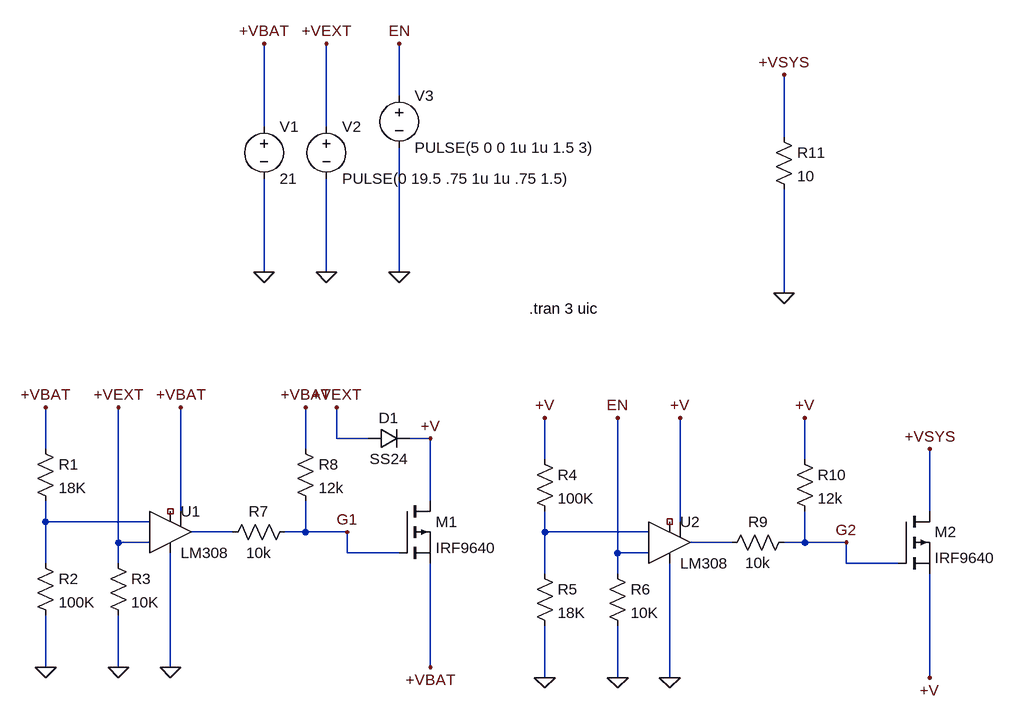
[diagram p0: schematic Arbitrador de Fuente.asc]
Arbitrador de Fuente.asc, the LTspice schematic file:
Version 4.1
SHEET 1 1296 680
WIRE 64 -544 64 -624
WIRE -144 -496 -144 -624
WIRE -48 -496 -48 -624
WIRE 656 -480 656 -576
WIRE -144 -272 -144 -416
WIRE -48 -272 -48 -416
WIRE 64 -272 64 -464
WIRE 656 -240 656 -400
WIRE -32 -16 -32 -64
WIRE 16 -16 -32 -16
WIRE 112 -16 80 -16
WIRE -480 0 -480 -64
WIRE -80 0 -80 -64
WIRE 288 16 288 -48
WIRE 688 16 688 -48
WIRE 112 80 112 -16
WIRE -272 96 -272 -64
WIRE 880 96 880 0
WIRE -480 112 -480 80
WIRE -320 112 -480 112
WIRE 496 112 496 -48
WIRE -192 128 -256 128
WIRE -80 128 -80 80
WIRE -80 128 -112 128
WIRE -16 128 -80 128
WIRE 288 128 288 96
WIRE 448 128 288 128
WIRE -368 144 -368 -64
WIRE -320 144 -368 144
WIRE 576 144 512 144
WIRE 688 144 688 96
WIRE 688 144 656 144
WIRE 752 144 688 144
WIRE -16 160 -16 128
WIRE 64 160 -16 160
WIRE 400 160 400 -48
WIRE 448 160 400 160
WIRE -480 176 -480 112
WIRE -368 176 -368 144
WIRE 752 176 752 144
WIRE 832 176 752 176
WIRE 288 192 288 128
WIRE 400 192 400 160
WIRE -480 336 -480 256
WIRE -368 336 -368 256
WIRE -288 336 -288 160
WIRE 112 336 112 176
WIRE 288 352 288 272
WIRE 400 352 400 272
WIRE 480 352 480 176
WIRE 880 352 880 192
FLAG -144 -272 0
FLAG -144 -624 +VBAT
FLAG -48 -272 0
FLAG -48 -624 +VEXT
FLAG 112 336 +VBAT
FLAG -32 -64 +VEXT
FLAG -480 336 0
FLAG -480 -64 +VBAT
FLAG -368 -64 +VEXT
FLAG -368 336 0
FLAG -272 -64 +VBAT
FLAG -16 128 G1
FLAG -288 336 0
FLAG 64 -624 EN
FLAG 64 -272 0
FLAG 112 -16 +V
FLAG -80 -64 +VBAT
FLAG 288 352 0
FLAG 400 352 0
FLAG 752 144 G2
FLAG 480 352 0
FLAG 880 0 +VSYS
FLAG 288 -48 +V
FLAG 880 352 +V
FLAG 496 -48 +V
FLAG 688 -48 +V
FLAG 400 -48 EN
FLAG 656 -240 0
FLAG 656 -576 +VSYS
SYMBOL voltage -144 -512 R0
WINDOW 123 0 0 Left 0
WINDOW 39 0 0 Left 0
SYMATTR InstName V1
SYMATTR Value 21
SYMBOL pmos 64 80 R0
SYMATTR InstName M1
SYMATTR Value IRF9640
SYMBOL diode 16 0 R270
WINDOW 0 32 32 VTop 2
WINDOW 3 0 32 VBottom 2
SYMATTR InstName D1
SYMATTR Value SS24
SYMBOL OpAmps\\LM308 -288 64 R0
SYMATTR InstName U1
SYMBOL res -496 -16 R0
SYMATTR InstName R1
SYMATTR Value 18K
SYMBOL res -496 160 R0
SYMATTR InstName R2
SYMATTR Value 100K
SYMBOL res -384 160 R0
SYMATTR InstName R3
SYMATTR Value 10K
SYMBOL voltage -48 -512 R0
WINDOW 123 0 0 Left 0
WINDOW 39 0 0 Left 0
SYMATTR InstName V2
SYMATTR Value PULSE(0 19.5 .75 1u 1u .75 1.5)
SYMBOL voltage 64 -560 R0
WINDOW 123 0 0 Left 0
WINDOW 39 0 0 Left 0
SYMATTR InstName V3
SYMATTR Value PULSE(5 0 0 1u 1u 1.5 3)
SYMBOL res -96 112 R90
WINDOW 0 0 56 VBottom 2
WINDOW 3 32 56 VTop 2
SYMATTR InstName R7
SYMATTR Value 10k
SYMBOL res -96 -16 R0
SYMATTR InstName R8
SYMATTR Value 12k
SYMBOL pmos 832 96 R0
SYMATTR InstName M2
SYMATTR Value IRF9640
SYMBOL OpAmps\\LM308 480 80 R0
SYMATTR InstName U2
SYMBOL res 272 0 R0
SYMATTR InstName R4
SYMATTR Value 100K
SYMBOL res 272 176 R0
SYMATTR InstName R5
SYMATTR Value 18K
SYMBOL res 384 176 R0
SYMATTR InstName R6
SYMATTR Value 10K
SYMBOL res 672 128 R90
WINDOW 0 0 56 VBottom 2
WINDOW 3 32 56 VTop 2
SYMATTR InstName R9
SYMATTR Value 10k
SYMBOL res 672 0 R0
SYMATTR InstName R10
SYMATTR Value 12k
SYMBOL res 640 -496 R0
SYMATTR InstName R11
SYMATTR Value 10
TEXT 264 -216 Left 2 !.tran 3 uic

The netlist it stands for:
* Arbitrador de Fuente.asc
V1 +VBAT 0 21
M1 +V G1 +VBAT +VBAT IRF9640
D1 +VEXT +V SS24
X§U1 +VEXT N001 +VBAT 0 N002 NC_01 NC_02 LT1008
R1 +VBAT N001 18K
R2 N001 0 100K
R3 +VEXT 0 10K
V2 +VEXT 0 PULSE(0 19.5 .75 1u 1u .75 1.5)
V3 EN 0 PULSE(5 0 0 1u 1u 1.5 3)
R7 G1 N002 10k
R8 +VBAT G1 12k
M2 +VSYS G2 +V +V IRF9640
X§U2 EN N003 +V 0 N004 NC_03 NC_04 LT1008
R4 +V N003 100K
R5 N003 0 18K
R6 EN 0 10K
R9 G2 N004 10k
R10 +V G2 12k
R11 +VSYS 0 10
.model D D
.lib standard.dio
.model NMOS NMOS
.model PMOS PMOS
.lib standard.mos
.tran 3 uic
.lib LTC.lib
.backanno
.end